# EAGLE design Breakout_Board (EAGLE 7.2.0)
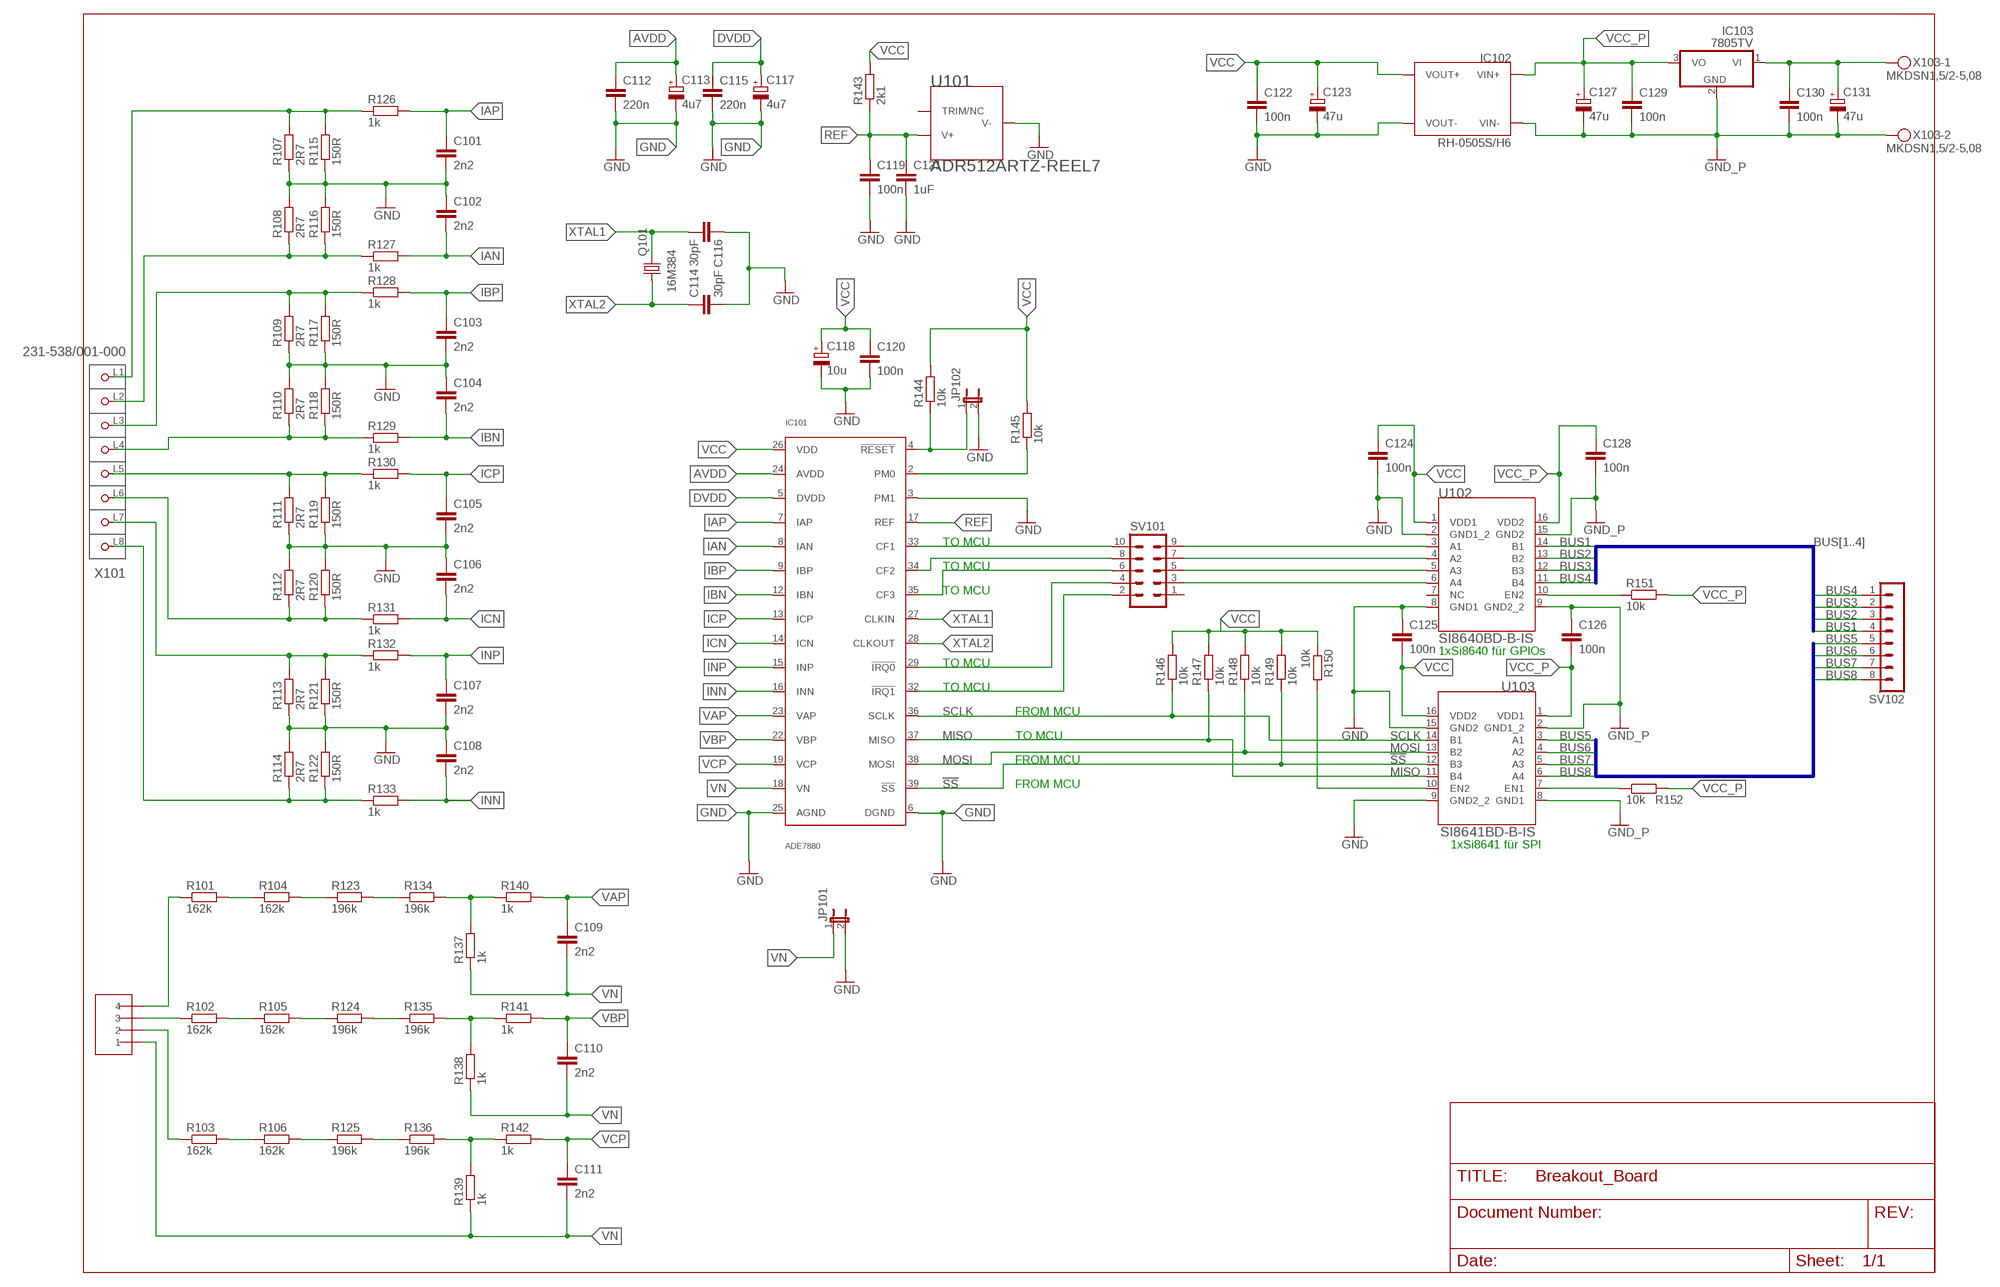
[diagram p0: schematic, sheet 1]

## Parts
C101  2n2  C-EUC0603K  [C0603K]
C102  2n2  C-EUC0603K  [C0603K]
C103  2n2  C-EUC0603K  [C0603K]
C104  2n2  C-EUC0603K  [C0603K]
C105  2n2  C-EUC0603K  [C0603K]
C106  2n2  C-EUC0603K  [C0603K]
C107  2n2  C-EUC0603K  [C0603K]
C108  2n2  C-EUC0603K  [C0603K]
C109  2n2  C-EUC0603K  [C0603K]
C110  2n2  C-EUC0603K  [C0603K]
C111  2n2  C-EUC0603K  [C0603K]
C112  220n  C-EUC0603K  [C0603K]
C113  4u7  CPOL-EUB  [PANASONIC_B]
C114  30pF  C-EUC0603K  [C0603K]
C115  220n  C-EUC0603K  [C0603K]
C116  30pF  C-EUC0603K  [C0603K]
C117  4u7  CPOL-EUB  [PANASONIC_B]
C118  10u  CPOL-EUB  [PANASONIC_B]
C119  100n  C-EUC0603K  [C0603K]
C120  100n  C-EUC0603K  [C0603K]
C121  1uF  C-EUC0603K  [C0603K]
C122  100n  C-EUC0603K  [C0603K]
C123  47u  CPOL-EUD  [PANASONIC_D]
C124  100n  C-EUC0603K  [C0603K]
C125  100n  C-EUC0603K  [C0603K]
C126  100n  C-EUC0603K  [C0603K]
C127  47u  CPOL-EUD  [PANASONIC_D]
C128  100n  C-EUC0603K  [C0603K]
C129  100n  C-EUC0603K  [C0603K]
C130  100n  C-EUC0603K  [C0603K]
C131  47u  CPOL-EUD  [PANASONIC_D]
IC101  ADE7880  [BREAKOUT40P]
IC102  RH-0505S/H6  [RH/H6]
IC103  7805TV  [TO220V]
JP101  JP1E  [JP1]
JP102  JP1E  [JP1]
Q101  16M384  CRYSTALHC49UP  [HC49UP]
R101  162k  R-EU_R0805  [R0805]
R102  162k  R-EU_R0805  [R0805]
R103  162k  R-EU_R0805  [R0805]
R104  162k  R-EU_R0805  [R0805]
R105  162k  R-EU_R0805  [R0805]
R106  162k  R-EU_R0805  [R0805]
R107  2R7  R-EU_R0805  [R0805]
R108  2R7  R-EU_R0805  [R0805]
R109  2R7  R-EU_R0805  [R0805]
R110  2R7  R-EU_R0805  [R0805]
R111  2R7  R-EU_R0805  [R0805]
R112  2R7  R-EU_R0805  [R0805]
R113  2R7  R-EU_R0805  [R0805]
R114  2R7  R-EU_R0805  [R0805]
R115  150R  R-EU_R0805  [R0805]
R116  150R  R-EU_R0805  [R0805]
R117  150R  R-EU_R0805  [R0805]
R118  150R  R-EU_R0805  [R0805]
R119  150R  R-EU_R0805  [R0805]
R120  150R  R-EU_R0805  [R0805]
R121  150R  R-EU_R0805  [R0805]
R122  150R  R-EU_R0805  [R0805]
R123  196k  R-EU_R0805  [R0805]
R124  196k  R-EU_R0805  [R0805]
R125  196k  R-EU_R0805  [R0805]
R126  1k  R-EU_R0603  [R0603]
R127  1k  R-EU_R0603  [R0603]
R128  1k  R-EU_R0603  [R0603]
R129  1k  R-EU_R0603  [R0603]
R130  1k  R-EU_R0603  [R0603]
R131  1k  R-EU_R0603  [R0603]
R132  1k  R-EU_R0603  [R0603]
R133  1k  R-EU_R0603  [R0603]
R134  196k  R-EU_R0805  [R0805]
R135  196k  R-EU_R0805  [R0805]
R136  196k  R-EU_R0805  [R0805]
R137  1k  R-EU_R0805  [R0805]
R138  1k  R-EU_R0805  [R0805]
R139  1k  R-EU_R0805  [R0805]
R140  1k  R-EU_R0603  [R0603]
R141  1k  R-EU_R0603  [R0603]
R142  1k  R-EU_R0603  [R0603]
R143  2k1  R-EU_R0603  [R0603]
R144  10k  R-EU_R0603  [R0603]
R145  10k  R-EU_R0603  [R0603]
R146  10k  R-EU_R0603  [R0603]
R147  10k  R-EU_R0603  [R0603]
R148  10k  R-EU_R0603  [R0603]
R149  10k  R-EU_R0603  [R0603]
R150  10k  R-EU_R0603  [R0603]
R151  10k  R-EU_R0603  [R0603]
R152  10k  R-EU_R0603  [R0603]
SV101  MA05-2  [MA05-2]
SV102  MA08-1  [MA08-1]
U101  ADR512ARTZ-REEL7  [RT_3]
U102  SI8640BD-B-IS  [SOIC-16W]
U103  SI8641BD-B-IS  [SOIC-16W]
X101  231-538/001-000  [P-231-538/001-000]
X102  STL266-04  [7.62MM-4POL]
X103  MKDSN1,5/2-5,08  [MKDSN1,5/2-5,08]

## Nets
!SS: IC101.39(!SS) R149.1 U103.12(B3)
AVDD: C112.1 C113.+ IC101.24(AVDD)
BUS1 [LoV Primary]: SV102.4 U102.14(B1)
BUS2 [LoV Primary]: SV102.3 U102.13(B2)
BUS3 [LoV Primary]: SV102.2 U102.12(B3)
BUS4 [LoV Primary]: SV102.1 U102.11(B4)
BUS5 [LoV Primary]: SV102.5 U103.3(A1)
BUS6 [LoV Primary]: SV102.6 U103.4(A2)
BUS7 [LoV Primary]: SV102.7 U103.5(A3)
BUS8 [LoV Primary]: SV102.8 U103.6(A4)
DVDD: C115.1 C117.+ IC101.5(DVDD)
GND: C101.2 C102.1 C103.2 C104.1 C105.2 C106.1 C107.2 C108.1 C112.2 C113.- C114.2 C115.2 C116.1 C117.- C118.- C119.2 C120.2 C121.2 C122.2 C123.- C124.2 C125.1 IC101.3(PM1) IC101.6(DGND) IC101.25(AGND) IC102.P$3(VOUT-) JP101.2 JP102.2 R107.1 R108.2 R109.1 R110.2 R111.1 R112.2 R113.1 R114.2 R115.1 R116.2 R117.1 R118.2 R119.1 R120.2 R121.1 R122.2 U101.2(V-) U102.2(GND1_2) U102.8(GND1) U103.9(GND2_2) U103.15(GND2)
GND_P [LoV Primary]: C126.1 C127.- C128.2 C129.2 C130.2 C131.- IC102.P$2(VIN-) IC103.2(GND) U102.9(GND2_2) U102.15(GND2) U103.2(GND1_2) U103.8(GND1) X103.2
IAN: C102.2 IC101.8(IAN) R127.2
IAP: C101.1 IC101.7(IAP) R126.2
IBN: C104.2 IC101.12(IBN) R129.2
IBP: C103.1 IC101.9(IBP) R128.2
ICN: C106.2 IC101.14(ICN) R131.2
ICP: C105.1 IC101.13(ICP) R130.2
INH: R113.2 R121.2 R132.1 X101.L7(P7)
INL [HIghI]: R114.1 R122.1 R133.1 X101.L8(P8)
INN: C108.2 IC101.16(INN) R133.2
INP: C107.1 IC101.15(INP) R132.2
L1H: R107.2 R115.2 R126.1 X101.L1(P1)
L1L: R108.1 R116.1 R127.1 X101.L2(P2)
L2H: R109.2 R117.2 R128.1 X101.L3(P3)
L2L: R110.1 R118.1 R129.1 X101.L4(P4)
L3H: R111.2 R119.2 R130.1 X101.L5(P5)
L3L: R112.1 R120.1 R131.1 X101.L6(P6)
MISO: IC101.37(MISO) R147.1 U103.11(B4)
MOSI: IC101.38(MOSI) R148.1 U103.13(B2)
N$1 [HighU]: R101.2 R104.1
N$2 [HighU]: R104.2 R123.1
N$3 [HighU]: R123.2 R134.1
N$4 [HighU]: R134.2 R137.2 R140.1
N$5 [HighU]: R101.1 X102.P$4
N$6 [HighU]: R102.2 R105.1
N$7 [HighU]: R105.2 R124.1
N$8 [HighU]: R124.2 R135.1
N$9 [HighU]: R135.2 R138.2 R141.1
N$10: R102.1 X102.P$3
N$11 [HighU]: R103.2 R106.1
N$12 [HighU]: R106.2 R125.1
N$13 [HighU]: R125.2 R136.1
N$14 [HighU]: R136.2 R139.2 R142.1
N$15 [HighU]: R103.1 X102.P$2
N$16: R150.2 U103.10(EN2)
N$25: IC101.2(PM0) R145.1
N$30: IC101.4(!RESET) JP102.1 R144.1
N$31: SV101.9 U102.3(A1)
N$32: SV101.7 U102.4(A2)
N$33: SV101.5 U102.5(A3)
N$34: SV101.3 U102.6(A4)
N$35: IC101.33(CF1) SV101.10
N$36: IC101.34(CF2) SV101.8
N$37: IC101.35(CF3) SV101.6
N$38: IC101.29(!IRQ0) SV101.4
N$39: IC101.32(!IRQ1) SV101.2
N$40 [LoV Primary]: R152.1 U103.7(EN1)
N$41 [LoV Primary]: R151.1 U102.10(EN2)
N$46 [LoV Primary]: C130.1 C131.+ IC103.1(VI) X103.1
REF: C119.1 C121.1 IC101.17(REF) R143.1 U101.1(V+)
SCLK: IC101.36(SCLK) R146.1 U103.14(B1)
VAP: C109.1 IC101.23(VAP) R140.2
VBP: C110.1 IC101.22(VBP) R141.2
VCC: C118.+ C120.1 C122.1 C123.+ C124.1 C125.2 IC101.26(VDD) IC102.P$5(VOUT+) R143.2 R144.2 R145.2 R146.2 R147.2 R148.2 R149.2 R150.1 U102.1(VDD1) U103.16(VDD2)
VCC_P [LoV Primary]: C126.2 C127.+ C128.1 C129.1 IC102.P$1(VIN+) IC103.3(VO) R151.2 R152.2 U102.16(VDD2) U103.1(VDD1)
VCP: C111.1 IC101.19(VCP) R142.2
VN: C109.2 C110.2 C111.2 IC101.18(VN) JP101.1 R137.1 R138.1 R139.1 X102.P$1
XTAL1: C116.2 IC101.27(CLKIN) Q101.2
XTAL2: C114.1 IC101.28(CLKOUT) Q101.1
Unconnected: SV101.1 U101.3(TRIM/NC) U102.7(NC)

## Buses
BUS[1..4]
BUS[5..8]

## Notes on the sheet
- TO MCU
- TO MCU
- TO MCU
- 1xSi8640 für GPIOs
- TO MCU
- TO MCU
- FROM MCU
- TO MCU
- FROM MCU
- FROM MCU
- 1xSi8641 für SPI

## Library data of the parts
C101-C112 C114-C116 C119-C122 C124-C126 C128-C130 = rcl:C-EU: CAPACITOR, European symbol
C113 C117 C118 C123 C127 C131 = rcl:CPOL-EU: POLARIZED CAPACITOR, European symbol
IC101 = AnalogDevices_own:ADE7880
IC102 = recom_own:RH-0505S/H6
IC103 = linear:78*: Positive VOLTAGE REGULATOR Source: http://cache.national.com/ds/LM/LM78L05.pdf http://www.fairchildsemi.com/ds/LM/LM7805.pdf
JP101 JP102 = jumper:JP1E: JUMPER
Q101 = crystal:CRYSTAL: CRYSTAL; OC_FARNELL: unknown; OC_NEWARK: unknown
R101-R152 = rcl:R-EU_: RESISTOR, European symbol
SV101 = con-lstb:MA05-2: PIN HEADER; OC_FARNELL: unknown; OC_NEWARK: unknown
SV102 = con-lstb:MA08-1: PIN HEADER; OC_FARNELL: unknown; OC_NEWARK: unknown
U101 = ADR512:ADR512ARTZ-REEL7; MANUFACTURER_PART_NUMBER: ADR512ARTZ-REEL7; VENDOR: Vendor
U102 = Si8640:SI8640BD-B-IS
U103 = Si8641:SI8641BD-B-IS
X101 = con-wago_5.08mm:231-538/001-000: Serie 231, Stiftleiste mit abgewinkelten Einlötstiften / Series 231, Male connector with angled solder pins Polzahl / Pole No.: 8 Rastermaß / Pitch: 5.08 - 5.08 mm Bemessungsspannung / Rated Voltage: 320 V Nennstrom / Nominal Current: 12 A Lötstiftlänge: / Solder Pin Length: 3.8 mm Farbe / Color: orange / orange Stand: 01.01.2014. Die jeweils aktuellen Daten zu diesem Artikel finden Sie in unserem Produktkatalog, den Sie unter www.wago.com einsehen können. As of: 01/01/2014. Please find the newest data for this article in our product catalogue, which can be viewed under www.wago.com.
X102 = con-riacon:STL266-04
X103 = con-phoenix-508:MKDSN1,5/2-5,08: MKDSN 1,5/ 2-5,08 Printklemme Nennstrom: 13,5 A Nennspannung: 250 V Rastermaß: 5,08 mm Polzahl: 2 Anschlussart: Schraubanschluss Montage: Löten Anschlussrichtung Leiter/Platine: 0 ° Artikelnummer: 1729128 Source: http://eshop.phoenixcontact.com .. 1729128.pdf

## Net classes
1 HighU: clearance 0.025 mm to class 0
2 HIghI: clearance 0.025 mm to class 0, clearance 2 mm to class 1
3 LoV Primary: clearance 5.5 mm to class 0, clearance 5.5 mm to class 1, clearance 5.5 mm to class 2

## Board
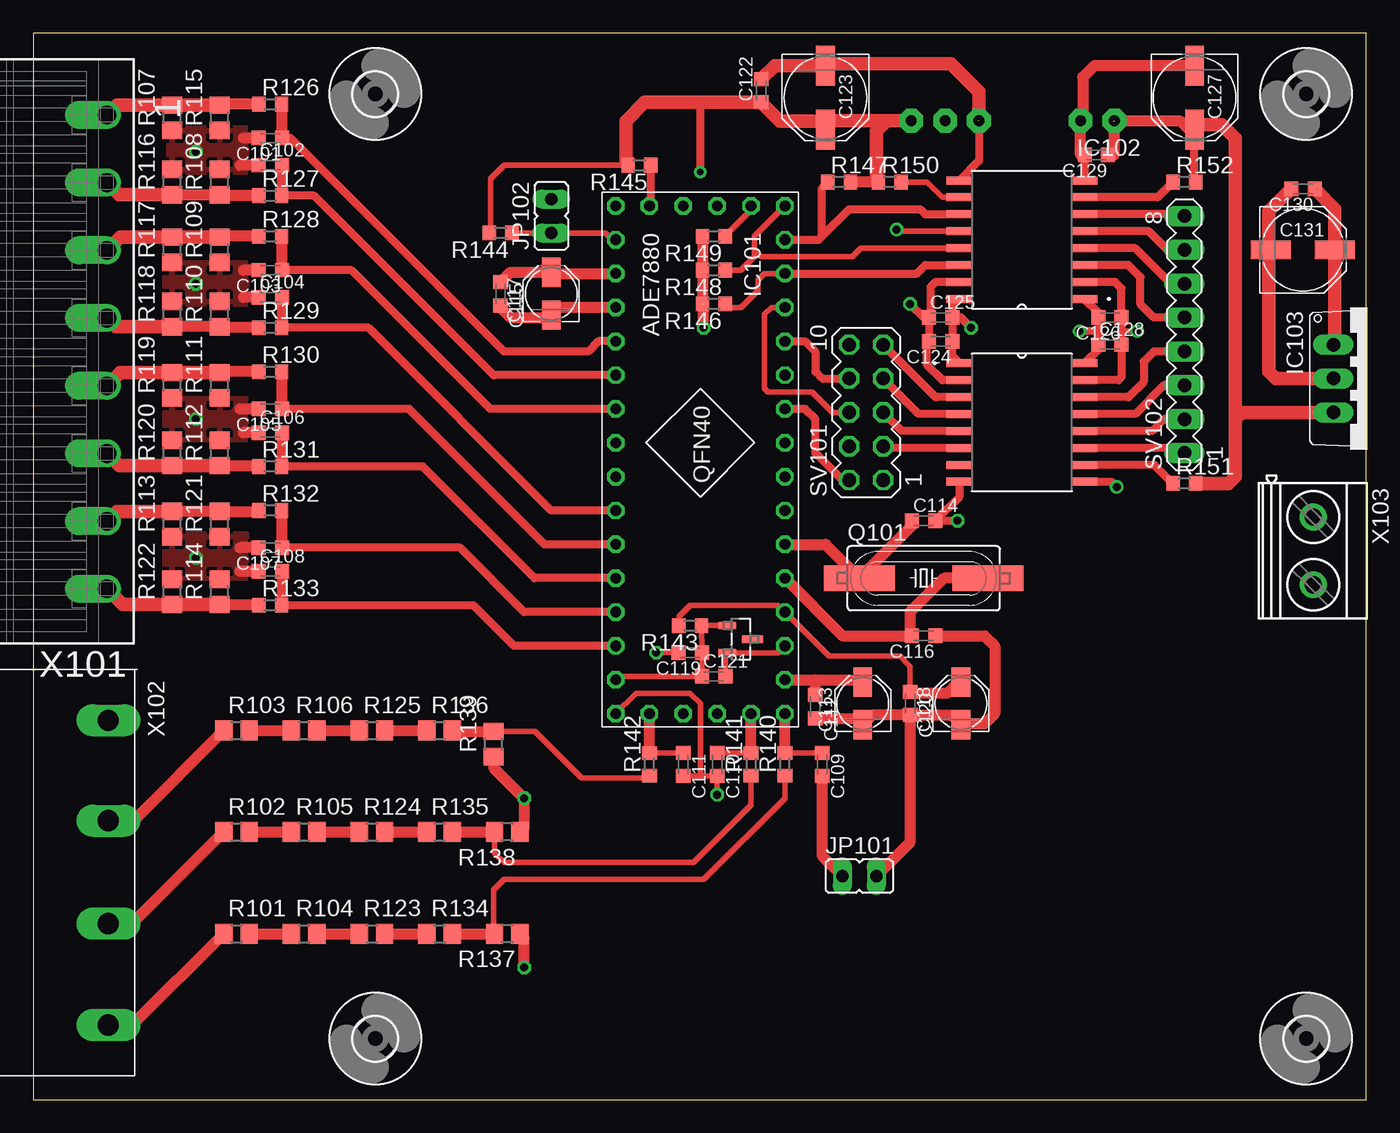
[diagram p1: board, top side]
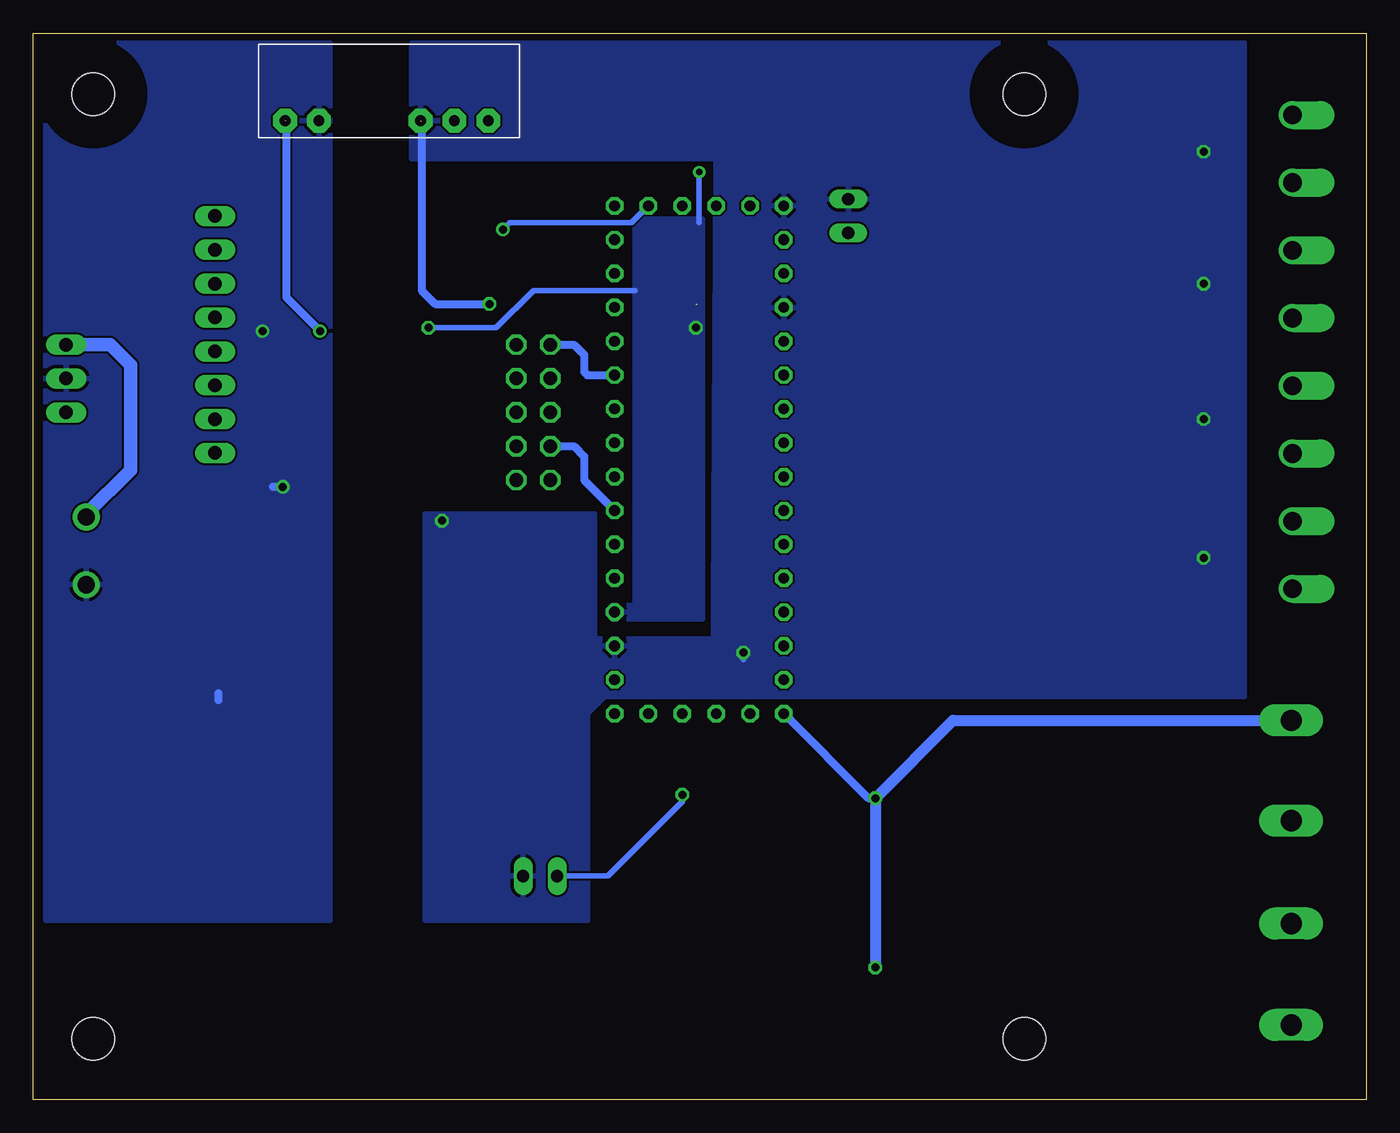
[diagram p2: board, bottom side, seen from below]

Size 100 x 80 mm. Coordinates in mm from the lower left corner, seen from the top.
Outline: 0,0 100,0 100,80 0,80 0,0
Copper layers (1*16): Top 0.035mm / dielectric 1.5mm / Bottom 0.035mm
Design rules "platinenbelichter *": minimum track width 0.18mm, minimum drill 0.4mm, track to track 6mil, track to pad 6mil, pad to pad 6mil, via to via 6mil, smd to smd 0mil, copper to edge 0.5mm, drill to drill 8mil, minimum pad ring 10mil, minimum via ring 8mil, stop-mask expansion 4mil, vias tented up to drill 0mil, thermal gap 10mil

### Footprints (pad centres in the part's own frame; a part is rotated, then mirrored left to right if it is on the bottom)
C0603K = smd 1.05 x 1.08: 1 -0.875,0; 2 0.875,0
PANASONIC_B = smd 2.2 x 1.4: + 1.6,0; - -1.6,0
PANASONIC_D = smd 3 x 1.4: + 2.4,0; - -2.4,0
BREAKOUT40P = drill 0.8 octagon: 1 0,5.08; 2 0,2.54; 3 0,0; 4 2.54,0; 5 5.08,0; 6 7.62,0; 7 10.16,0; 8 12.7,0; 9 15.24,0; 10 17.78,0; 11 20.32,0; 12 22.86,0; 13 25.4,0; 14 27.94,0; 15 30.48,0; 16 33.02,0; 17 35.56,0; 18 38.1,0; 19 38.1,2.54; 20 38.1,5.08; 21 38.1,7.62; 22 38.1,10.16; 23 38.1,12.7; 24 35.56,12.7; 25 33.02,12.7; 26 30.48,12.7; 27 27.94,12.7; 28 25.4,12.7; 29 22.86,12.7; 30 20.32,12.7; 31 17.78,12.7; 32 15.24,12.7; 33 12.7,12.7; 34 10.16,12.7; 35 7.62,12.7; 36 5.08,12.7; 37 2.54,12.7; 38 0,12.7; 39 0,10.16; 40 0,7.62
RH/H6 = drill 0.8 pad 1.778 octagon: P$1 -7.7,2.5; P$2 -5.16,2.5; P$3 2.46,2.5; P$4 5,2.5; P$5 7.54,2.5
TO220V = drill 1.016 long: 1 -2.54,-2.54; 2 0,-2.54; 3 2.54,-2.54
JP1 = drill 0.914 long: 1 0,-1.27; 2 0,1.27
HC49UP = smd 5.334 x 1.93: 1 -4.826,0; 2 4.826,0
R0805 = smd 1.3 x 1.5: 1 -0.95,0; 2 0.95,0
R0603 = smd 1 x 1.1: 1 -0.85,0; 2 0.85,0
MA05-2 = drill 1.016 octagon: 1 -5.08,-1.27; 2 -5.08,1.27; 3 -2.54,-1.27; 4 -2.54,1.27; 5 0,-1.27; 6 0,1.27; 7 2.54,-1.27; 8 2.54,1.27; 9 5.08,-1.27; 10 5.08,1.27
MA08-1 = drill 1.016 long: 1 -8.89,0; 2 -6.35,0; 3 -3.81,0; 4 -1.27,0; 5 1.27,0; 6 3.81,0; 7 6.35,0; 8 8.89,0
RT_3 = smd 0.559 x 1.321: 1 -1.025,-1.016; 2 1.025,-1.016 | smd 0.559 x 1.587: 3 0,0.883
SOIC-16W = smd 1.9 x 0.6: 1 -4.7,4.445; 2 -4.7,3.175; 3 -4.7,1.905; 4 -4.7,0.635; 5 -4.7,-0.635; 6 -4.7,-1.905; 7 -4.7,-3.175; 8 -4.7,-4.445; 9 4.7,-4.445; 10 4.7,-3.175; 11 4.7,-1.905; 12 4.7,-0.635; 13 4.7,0.635; 14 4.7,1.905; 15 4.7,3.175; 16 4.7,4.445
3,2 = hole 3.2: 0,0
P-231-538/001-000 = drill 1.4 offset: L1 -4,-17.74; L2 -4,-12.66; L3 -4,-7.58; L4 -4,-2.5; L5 -4,2.58; L6 -4,7.66; L7 -3.99,12.74; L8 -4,17.82
7.62MM-4POL = drill 1.6 long: P$1 3.81,-2; P$2 11.34,-2; P$3 19.05,-2; P$4 26.67,-2
MKDSN1,5/2-5,08 = drill 1.3 pad 2: 1 -2.561,0.025; 2 2.519,0.025

### Placement (x,y rotation side)
C101  17.78,72.14 180 top
C102  17.78,70.1 0 top
C103  17.78,62.23 180 top
C104  17.78,60.2 0 top
C105  17.78,51.82 180 top
C106  17.78,50.04 0 top
C107  17.78,41.4 180 top
C108  17.78,39.62 0 top
C109  59.18,25.15 270 top
C110  51.31,25.15 270 top
C111  48.77,25.15 270 top
C112  58.67,29.46 270 top
C113  62.23,29.72 90 top
C114  66.8,43.43 0 top
C115  35.05,60.45 270 top
C116  66.8,34.8 180 top
C117  38.86,60.45 90 top
C118  69.6,29.72 90 top
C119  49.28,33.53 180 top
C120  65.79,29.72 270 top
C121  51.05,31.75 0 top
C122  54.61,75.69 90 top
C123  59.44,75.18 270 top
C124  68.07,56.9 180 top
C125  68.07,58.67 0 top
C126  80.77,58.67 180 top
C127  87.12,75.18 270 top
C128  80.77,56.64 0 top
C129  79.76,70.87 180 top
C130  95.25,68.33 180 top
C131  95.25,63.75 0 top
IC101  43.69,67.06 270 top
IC102  73.41,75.95 180 top
IC103  100.08,54.1 270 top
JP101  61.98,16.76 270 top
JP102  38.86,66.29 0 top
Q101  66.8,39.12 0 top
R101  15.24,12.45 0 top
R102  15.24,20.07 0 top
R103  15.24,27.69 0 top
R104  20.32,12.45 0 top
R105  20.32,20.07 0 top
R106  20.32,27.69 0 top
R107  10.41,73.66 90 top
R108  13.97,68.83 90 top
R109  13.97,63.75 90 top
R110  13.97,58.93 90 top
R111  13.97,53.59 90 top
R112  13.97,48.51 90 top
R113  10.41,43.18 90 top
R114  13.97,38.1 90 top
R115  13.97,73.66 90 top
R116  10.41,68.83 90 top
R117  10.41,63.75 90 top
R118  10.41,58.93 90 top
R119  10.41,53.59 90 top
R120  10.41,48.51 90 top
R121  13.97,43.18 90 top
R122  10.41,38.1 90 top
R123  25.4,12.45 0 top
R124  25.4,20.07 0 top
R125  25.4,27.69 0 top
R126  17.78,74.68 0 top
R127  17.78,67.82 0 top
R128  17.78,64.77 0 top
R129  17.78,57.91 0 top
R130  17.78,54.61 0 top
R131  17.78,47.5 0 top
R132  17.78,44.2 0 top
R133  17.78,37.08 0 top
R134  30.48,12.45 0 top
R135  30.48,20.07 0 top
R136  30.48,27.69 0 top
R137  35.56,12.45 180 top
R138  35.56,20.07 180 top
R139  34.54,26.67 90 top
R140  56.39,25.15 90 top
R141  53.85,25.15 90 top
R142  46.23,25.15 90 top
R143  49.28,35.56 180 top
R144  35.05,65.02 180 top
R145  45.47,70.1 180 top
R146  51.05,59.69 180 top
R147  60.45,68.83 0 top
R148  51.05,62.23 180 top
R149  51.05,64.77 180 top
R150  64.26,68.83 0 top
R151  86.36,46.23 0 top
R152  86.36,68.83 0 top
SV101  62.48,51.56 90 top
SV102  86.36,57.4 90 top
U101  53.09,34.54 270 top
U102  74.17,50.8 0 top
U103  74.17,64.52 180 top
U$1  [3,2]  25.65,4.57 0 top
U$2  [3,2]  95.5,4.57 0 top
U$3  [3,2]  25.65,75.44 0 top
U$4  [3,2]  95.5,75.44 0 top
X101  1.52,56.13 180 top
X102  7.62,32.26 270 top
X103  96.01,41.15 270 top

### Tracks (layer width: path | path; a pad name or v marks a point on that pad's centre or on a via)
!SS  (via drill 0.6)
  Top 0.406: U103.12 64.9,65.15 v64.77,65.28 | IC101.39 53.85,66.71 R149.1
  Bottom 0.406: v64.77,65.28 64.26,65.79 55.12,65.79 IC101.39
AVDD
  Top 0.813: IC101.24 58.67,31.5 | 58.67,31.5 62.05,31.5 C113.+ | C112.1 58.67,31.5
BUS1
  Top 0.61: SV102.4 84.07,56.13 83.31,55.37 83.31,53.85 82.17,52.7 U102.14
BUS2
  Top 0.61: SV102.3 84.84,53.59 82.68,51.44 U102.13
BUS3
  Top 0.61: SV102.2 84.84,51.05 83.95,50.16 U102.12
BUS4
  Top 0.61: SV102.1 85.98,48.9 U102.11
BUS5
  Top 0.61: SV102.5 84.07,58.67 83.06,59.69 83.06,61.72 82.17,62.61 U103.3
BUS6
  Top 0.61: SV102.6 85.34,61.21 82.68,63.88 U103.4
BUS7
  Top 0.61: SV102.7 85.09,63.75 83.69,65.15 U103.5
BUS8
  Top 0.61: SV102.8 86.23,66.42 U103.6
DVDD
  Top 0.813: IC101.5 38.94,61.98 C117.+ 35.78,62.05 C115.1
GND  (via drill 0.6)  (1 unrouted)
  Top 0.406: IC101.25 55.87,33.52 U101.2 51.93,33.38 C121.2 | C106.1 16.76,50.04 | C108.1 16.76,39.62 | C103.2 16.76,62.23 | C104.1 16.76,60.2 | C102.1 16.76,70.1 | C119.2 v46.74,33.53
  Top 0.61: IC102.P$3 70.95,70.44 U103.9 | U102.8 69.47,45.23 C114.2 v69.34,43.43 | C125.1 C124.2 67.06,56.76 67.06,55.12 68.2,53.98 U102.2 | U103.15 67.69,61.34 67.31,60.96 67.31,58.79 C125.1 | C125.1 66.8,58.67 v65.79,59.69
  Top 0.813: C120.2 68.87,28.84 C118.- 69.67,28.19 71.37,28.19 72.14,28.96 72.14,34.04 71.37,34.8 C116.1 | C120.2 65.79,19.3 JP101.2 | R107.1 10.6,72.71 | C115.2 35.05,59.44 35.81,58.67 38.68,58.67 C117.- 39.45,59.44 IC101.6 | 17.02,41.4 C107.2 15.49,41.4 | 16.76,39.62 15.49,39.62 | 16.76,50.04 15.75,50.04 | 17.02,51.82 C105.2 15.49,51.82 | 16.76,60.2 15.75,60.2 | 16.76,62.23 15.75,62.23 | 16.76,70.1 15.49,70.1 | 17.02,72.14 C101.2 15.75,72.14 | C112.2 61.76,28.59 C113.- 62.95,28.84 C120.2
  Top 1.016: IC102.P$3 70.95,75.61 68.83,77.72 59.58,77.72 C123.- 55.63,77.58 C122.2
  Bottom 0.406: v46.74,33.53 46.74,33.02
  Bottom 0.61: 70.87,73.41 70.87,60.71 69.85,59.69 v65.79,59.69
  other vias: 12.19,40.64 12.19,51.05 12.19,71.12 12.19,61.21
  pour Bottom: 71.63,79.25 9.14,79.25 9.14,30.23 49.02,30.23 48.77,70.61 71.63,70.61
  pour Bottom: 48.77,30.23 57.15,30.23 58.42,28.96 58.42,13.46 70.61,13.46 70.61,34.54 48.77,34.54
  pour Bottom: 57.91,34.54 57.91,43.94 70.61,43.94 70.61,34.54
  pour Top: 10.16,72.9 10.16,69.6 16,69.6 16,72.9
  pour Top: 9.91,62.74 16,62.74 16,59.69 9.91,59.69
  pour Top: 9.91,52.58 16,52.58 16,49.53 9.91,49.53
  pour Top: 9.91,42.42 16,42.42 16,39.12 9.91,39.12
GND_P  (via drill 0.6)
  Top 0.406: v82.8,57.66 81.53,57.66 81.65,57.77 C126.1
  Top 0.61: U103.2 81.15,61.34 81.65,60.85 C126.1 C128.2 81.65,54.22 81.41,53.98 U102.15 | U103.8 78.88,68.97 C129.2 | U102.9 80.9,46.35 v81.28,45.97
  Top 0.813: C129.2 78.57,70.87 IC102.P$2 78.74,73.62 78.74,76.71 79.62,77.58 C127.-
  Top 1.016: IC103.2 93.22,54.1 92.71,54.61 92.71,63.61 C131.- 92.71,63.89 92.71,66.66 C130.2
  Bottom 0.61: 86.11,29.97 86.11,30.48 | v81.28,45.97 82.04,45.97
  pour Bottom: 99.06,13.46 77.72,13.46 77.72,79.25 99.06,79.25
IAN
  Top 0.61: IC101.8 34.54,54.36 21.08,67.82 R127.2
  Top 0.813: C102.2 18.66,67.84 R127.2
IAP
  Top 0.61: IC101.7 42.42,56.9 41.66,56.13 35.31,56.13 19.3,72.14 C101.1
  Top 0.813: R126.2 18.63,72.16 C101.1
IBN
  Top 0.61: IC101.12 38.86,44.2 25.15,57.91 R129.2
  Top 0.813: C104.2 18.66,57.94 R129.2
IBP
  Top 0.61: IC101.9 34.29,51.82 23.88,62.23 C103.1
  Top 0.813: R128.2 18.63,62.26 C103.1
ICN
  Top 0.61: IC101.14 37.59,39.12 29.21,47.5 R131.2
  Top 0.813: C106.2 18.66,47.52 R131.2
ICP
  Top 0.61: IC101.13 38.35,41.66 28.19,51.82 C105.1
  Top 0.813: R130.2 18.63,51.84 C105.1
INH
  Top 0.813: R132.1 16.86,44.13 R121.2 R113.2
  Top 1.016: R113.2 6.25,44.13 X101.L7
INL
  Top 0.813: R114.1 16.86,37.15 R133.1
  Top 1.016: R114.1 R122.1 6.69,37.15 X101.L8
INN
  Top 0.61: IC101.16 36.07,34.04 33.02,37.08 R133.2
  Top 0.813: C108.2 18.66,37.11 R133.2
INP
  Top 0.61: IC101.15 36.83,36.58 32,41.4 C107.1
  Top 0.813: R132.2 18.63,41.43 C107.1
L1H
  Top 0.813: R126.1 13.53,74.68 13.46,74.61
  Top 1.016: R115.2 13.46,74.61 R107.2 6.26,74.61 X101.L1
L1L
  Top 0.813: R116.1 R108.1 14.04,67.82 R127.1
  Top 1.016: R116.1 6.43,67.88 X101.L2
L2H
  Top 0.813: R128.1 14.04,64.77 R109.2
  Top 1.016: R109.2 R117.2 6.51,64.7 X101.L3
L2L
  Top 0.813: R129.1 14.04,57.91 R110.1 R118.1
  Top 1.016: R118.1 6.18,57.98 X101.L4
L3H
  Top 0.813: R130.1 14.04,54.61 R111.2
  Top 1.016: R111.2 R119.2 6.51,54.54 X101.L5
L3L
  Top 0.813: R112.1 16.86,47.56 R131.1
  Top 1.016: R112.1 R120.1 6.43,47.56 X101.L6
MISO
  Top 0.406: 59.18,64.77 59.35,64.94
  Top 0.61: 59.18,64.77 61.21,66.8 66.55,66.8 66.93,66.42 U103.11 | IC101.37 58.93,64.52 59.18,64.77 | 59.18,64.77 59.18,68.41 R147.1
MOSI
  Top 0.406: U103.13 62.1,63.88 61.47,63.25 54.61,63.25 54.1,63.75 | 54.1,63.75 54.1,64.77 IC101.38 | 54.1,63.75 54.1,63.25 53.09,62.23 R148.1
N$1
  Top 0.813: R101.2 R104.1
N$2
  Top 0.813: R104.2 R123.1
N$3
  Top 0.813: R123.2 R134.1
N$4
  Top 0.406: R140.1 56.39,22.61 50.29,16.51 35.31,16.51 34.54,15.75 34.54,12.51 R137.2
  Top 0.813: R134.2 R137.2
N$5
  Top 0.813: R101.1 7.43,5.59 X102.P$4
N$6
  Top 0.813: R102.2 R105.1
N$7
  Top 0.813: R105.2 R124.1
N$8
  Top 0.813: R124.2 R135.1
N$9
  Top 0.406: 53.85,22.86 R141.1 53.85,22.1 49.53,17.78 35.31,17.78 34.61,18.48 R138.2
  Top 0.813: R135.2 R138.2
N$10
  Top 0.813: R102.1 7.43,13.21 X102.P$3
N$11
  Top 0.813: R103.2 R106.1
N$12
  Top 0.813: R106.2 R125.1
N$13
  Top 0.813: R125.2 R136.1
N$14
  Top 0.406: R142.1 46.06,24.13 41.15,24.13 37.66,27.62 R139.2
  Top 0.813: R136.2 31.5,27.62 R139.2
N$15
  Top 0.813: R103.1 7.52,20.92 X102.P$2
N$16
  Top 0.406: U103.10 68.2,67.69 67.06,68.83 R150.2
N$25
  Top 0.61: R145.1 46.32,67.14 IC101.2
N$30
  Top 0.406: IC101.4 43.43,64.52 42.93,65.02 JP102.1 R144.1
N$31
  Top 0.61: U102.3 67.69,52.7 SV101.9
N$32
  Top 0.61: U102.4 66.42,51.44 SV101.7
N$33
  Top 0.61: U102.5 65.15,50.16 SV101.5
N$34
  Top 0.61: U102.6 63.88,48.9 SV101.3
N$35
  Bottom 0.61: SV101.10 59.44,56.64 58.67,55.88 58.67,54.61 58.42,54.36 IC101.33
N$36
  Top 0.61: IC101.34 57.91,56.9 58.67,56.13 58.67,54.61 59.18,54.1 SV101.8
N$37
  Top 0.406: SV101.6 59.94,51.56 58.42,53.09 55.12,53.09 54.86,53.34 54.86,58.93 55.37,59.44 IC101.35
N$38
  Bottom 0.61: SV101.4 59.44,49.02 58.67,48.26 58.67,46.48 IC101.29
N$39
  Top 0.61: SV101.2 60.71,46.48 58.67,48.51 58.67,51.05 57.91,51.82 IC101.32
N$40
  Top 0.61: R152.1 84.37,67.69 U103.7
N$41
  Top 0.61: R151.1 84.11,47.62 U102.10
N$46
  Top 1.016: IC103.1 97.65,56.76 C131.+ 97.65,66.8 C130.1
  Bottom 1.016: X103.1 96.04,43.92 92.71,47.24 92.71,55.12 94.23,56.64 IC103.1
REF
  Top 0.406: U101.1 R143.1 C119.1 50.18,33.5 C121.1 43.94,31.75 IC101.17
SCLK
  Top 0.406: IC101.36 54.86,61.98 54.36,61.47 54.36,60.71 53.09,59.44 52.16,59.44 R146.1
  Top 0.61: IC101.36 66.29,61.98 66.93,62.61 U103.14
VAP
  Top 0.406: C109.1 56.41,26.02 R140.2
  Top 0.813: R140.2 IC101.23
VBP
  Top 0.406: R141.2 51.33,26 C110.1
  Top 0.813: R141.2 IC101.22
VCC  (via drill 0.5, 0.6)  (1 unrouted)
  Top 0.406: R143.2 48.43,36.23 49.28,37.08 55.88,37.08 IC101.26 59.69,33.27 65.02,33.27 65.79,32.51 C120.1 | R144.2 34.29,65.11 34.29,69.09 35.31,70.1 R145.2 43.43,70.1 | R150.1 63.25,69
  Top 0.61: U103.16 68.95,59.55 C125.2 | U102.1 68.95,55.77 C124.1 C125.2 | v50.04,69.6 50.04,74.82 | C125.2 69.6,58.67 v70.36,57.91
  Top 0.813: C118.+ 69.42,31.32 | 69.42,31.32 68.58,30.48 65.9,30.48 C120.1 | 69.42,31.32 69.42,31.42 | 63.25,69 63.16,69 62.99,68.83 R147.2 | R149.2 R148.2 R146.2 | v50.29,57.91 50.29,59.69
  Top 1.016: 59.44,73.41 59.48,73.45 IC102.P$5 64.05,73.45 63.25,72.64 63.25,69 | 59.44,73.41 C123.+ | 59.44,73.41 56.02,73.41 C122.1 50.04,74.82 45.86,74.82 44.45,73.41 44.45,70.27 R145.2
  Bottom 0.406: v50.04,69.6 50.04,65.79 | 54.86,60.71 62.48,60.71 65.28,57.91 v70.36,57.91
  pour Bottom: 49.78,66.04 54.86,66.04 54.86,37.08 56.9,37.08 56.9,36.07 49.78,36.07
VCC_P  (via drill 0.6)  (1 unrouted)
  Top 0.406: C126.2 79.9,57.8 79.76,57.66
  Top 0.61: U103.1 79.9,59.04 C126.2 C128.1 79.9,56.27 U102.16 | R152.2 87.12,68.92 C127.+ | 79.76,57.66 v78.49,57.66
  Top 0.813: C129.1 81.11,70.87 IC102.P$1 81.15,73.41 86.11,73.41 86.73,72.78 C127.+
  Top 1.016: IC103.3 90.68,51.56 90.17,51.05 | 90.17,51.05 90.17,46.74 89.66,46.23 R151.2 | 90.17,51.05 90.17,72.14 89.15,73.15 87.49,73.15 C127.+
  Bottom 0.61: 81.03,73.41 81.03,60.2 v78.49,57.66
VCP
  Top 0.406: R142.2 48.74,26 C111.1
  Top 0.813: R142.2 IC101.19
VN  (via drill 0.6)
  Top 0.406: C111.2 50.04,24.27 | 50.04,24.27 C110.2 v51.31,22.86 | IC101.18 45.21,30.48 49.28,30.48 50.04,29.72 50.04,24.27 | 36.83,20.39 36.83,20.32
  Top 0.813: R138.1 36.83,20.39 v36.83,22.61 34.54,24.89 R139.1 | v36.83,9.91 36.83,12.13 R137.1 | C109.2 59.18,18.29 JP101.1
  Bottom 0.406: v51.31,22.86 51.31,22.35 56.9,16.76 JP101.1
  Bottom 0.61: IC101.18 37.34,22.61 v36.83,22.61
  Bottom 0.813: v36.83,9.91 v36.83,22.61 30.99,28.45 X102.P$1
XTAL1
  Top 0.813: Q101.2 68.33,39.12 65.79,36.58 65.79,34.94 C116.2 60.71,34.8 IC101.27
XTAL2
  Top 0.813: IC101.28 59.44,41.66 Q101.1 65.93,43.07 C114.1